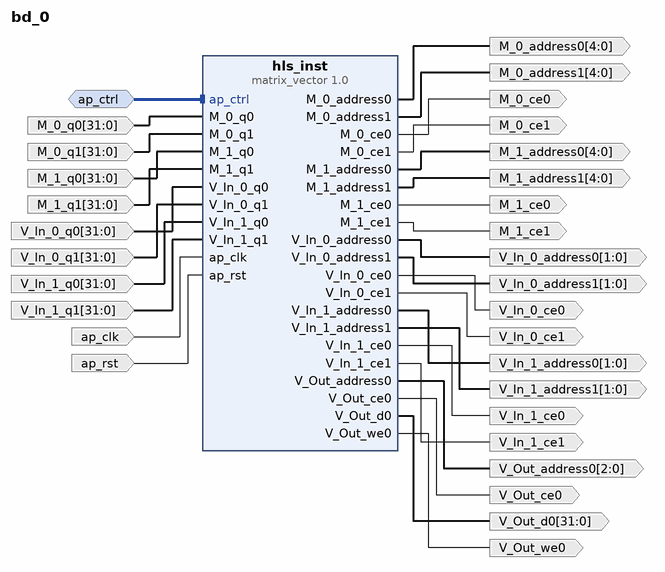
[diagram p0: block diagram of the top level]
# Vivado block design bd_0, xqzu5ev-ffrb900-1-i, Vivado 2020.1
create_bd_design bd_0

create_bd_intf_port -mode Slave -vlnv xilinx.com:interface:acc_handshake_rtl:1.0 ap_ctrl
create_bd_port -dir O -from 4 -to 0 -type data M_0_address0
create_bd_port -dir O -from 4 -to 0 -type data M_0_address1
create_bd_port -dir O M_0_ce0
create_bd_port -dir O M_0_ce1
create_bd_port -dir I -from 31 -to 0 -type data M_0_q0
create_bd_port -dir I -from 31 -to 0 -type data M_0_q1
create_bd_port -dir O -from 4 -to 0 -type data M_1_address0
create_bd_port -dir O -from 4 -to 0 -type data M_1_address1
create_bd_port -dir O M_1_ce0
create_bd_port -dir O M_1_ce1
create_bd_port -dir I -from 31 -to 0 -type data M_1_q0
create_bd_port -dir I -from 31 -to 0 -type data M_1_q1
create_bd_port -dir O -from 1 -to 0 -type data V_In_0_address0
create_bd_port -dir O -from 1 -to 0 -type data V_In_0_address1
create_bd_port -dir O V_In_0_ce0
create_bd_port -dir O V_In_0_ce1
create_bd_port -dir I -from 31 -to 0 -type data V_In_0_q0
create_bd_port -dir I -from 31 -to 0 -type data V_In_0_q1
create_bd_port -dir O -from 1 -to 0 -type data V_In_1_address0
create_bd_port -dir O -from 1 -to 0 -type data V_In_1_address1
create_bd_port -dir O V_In_1_ce0
create_bd_port -dir O V_In_1_ce1
create_bd_port -dir I -from 31 -to 0 -type data V_In_1_q0
create_bd_port -dir I -from 31 -to 0 -type data V_In_1_q1
create_bd_port -dir O -from 2 -to 0 -type data V_Out_address0
create_bd_port -dir O V_Out_ce0
create_bd_port -dir O -from 31 -to 0 -type data V_Out_d0
create_bd_port -dir O V_Out_we0
create_bd_port -dir I -type clk ap_clk
set_property -dict {CONFIG.FREQ_HZ 125000000.0} [get_bd_ports ap_clk]
create_bd_port -dir I -type rst ap_rst
set_property -dict {CONFIG.POLARITY ACTIVE_HIGH} [get_bd_ports ap_rst]

create_bd_cell -type ip -vlnv xilinx.com:hls:matrix_vector:1.0 hls_inst

# ---- connections ----

connect_bd_intf_net -intf_net ap_ctrl_0_1 [get_bd_intf_ports ap_ctrl] [get_bd_intf_pins hls_inst/ap_ctrl]
connect_bd_net [get_bd_pins hls_inst/M_0_address0] [get_bd_ports M_0_address0]
connect_bd_net [get_bd_pins hls_inst/M_0_address1] [get_bd_ports M_0_address1]
connect_bd_net [get_bd_pins hls_inst/M_0_ce0] [get_bd_ports M_0_ce0]
connect_bd_net [get_bd_pins hls_inst/M_0_ce1] [get_bd_ports M_0_ce1]
connect_bd_net -net M_0_q0_0_1 [get_bd_ports M_0_q0] [get_bd_pins hls_inst/M_0_q0]
connect_bd_net -net M_0_q1_0_1 [get_bd_ports M_0_q1] [get_bd_pins hls_inst/M_0_q1]
connect_bd_net [get_bd_pins hls_inst/M_1_address0] [get_bd_ports M_1_address0]
connect_bd_net [get_bd_pins hls_inst/M_1_address1] [get_bd_ports M_1_address1]
connect_bd_net [get_bd_pins hls_inst/M_1_ce0] [get_bd_ports M_1_ce0]
connect_bd_net [get_bd_pins hls_inst/M_1_ce1] [get_bd_ports M_1_ce1]
connect_bd_net -net M_1_q0_0_1 [get_bd_ports M_1_q0] [get_bd_pins hls_inst/M_1_q0]
connect_bd_net -net M_1_q1_0_1 [get_bd_ports M_1_q1] [get_bd_pins hls_inst/M_1_q1]
connect_bd_net [get_bd_pins hls_inst/V_In_0_address0] [get_bd_ports V_In_0_address0]
connect_bd_net [get_bd_pins hls_inst/V_In_0_address1] [get_bd_ports V_In_0_address1]
connect_bd_net [get_bd_pins hls_inst/V_In_0_ce0] [get_bd_ports V_In_0_ce0]
connect_bd_net [get_bd_pins hls_inst/V_In_0_ce1] [get_bd_ports V_In_0_ce1]
connect_bd_net -net V_In_0_q0_0_1 [get_bd_ports V_In_0_q0] [get_bd_pins hls_inst/V_In_0_q0]
connect_bd_net -net V_In_0_q1_0_1 [get_bd_ports V_In_0_q1] [get_bd_pins hls_inst/V_In_0_q1]
connect_bd_net [get_bd_pins hls_inst/V_In_1_address0] [get_bd_ports V_In_1_address0]
connect_bd_net [get_bd_pins hls_inst/V_In_1_address1] [get_bd_ports V_In_1_address1]
connect_bd_net [get_bd_pins hls_inst/V_In_1_ce0] [get_bd_ports V_In_1_ce0]
connect_bd_net [get_bd_pins hls_inst/V_In_1_ce1] [get_bd_ports V_In_1_ce1]
connect_bd_net -net V_In_1_q0_0_1 [get_bd_ports V_In_1_q0] [get_bd_pins hls_inst/V_In_1_q0]
connect_bd_net -net V_In_1_q1_0_1 [get_bd_ports V_In_1_q1] [get_bd_pins hls_inst/V_In_1_q1]
connect_bd_net [get_bd_pins hls_inst/V_Out_address0] [get_bd_ports V_Out_address0]
connect_bd_net [get_bd_pins hls_inst/V_Out_ce0] [get_bd_ports V_Out_ce0]
connect_bd_net [get_bd_pins hls_inst/V_Out_d0] [get_bd_ports V_Out_d0]
connect_bd_net [get_bd_pins hls_inst/V_Out_we0] [get_bd_ports V_Out_we0]
connect_bd_net -net ap_clk_0_1 [get_bd_ports ap_clk] [get_bd_pins hls_inst/ap_clk]
connect_bd_net -net ap_rst_0_1 [get_bd_ports ap_rst] [get_bd_pins hls_inst/ap_rst]

validate_bd_design
save_bd_design
